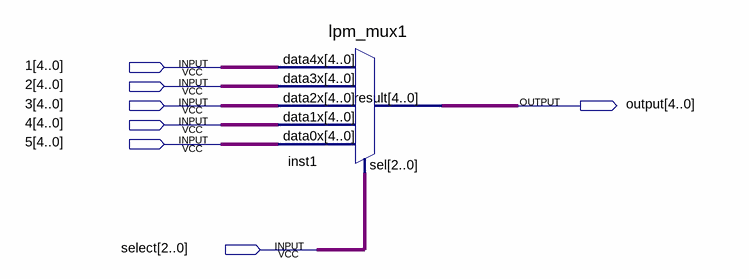
[diagram p0: schematic sheet]
// Quartus schematic mux_test.bdf as structural Verilog: 1 symbols, 7 pins
module mux_test (
  input  [4:0] \1 ,
  input  [4:0] \2 ,
  input  [4:0] \3 ,
  input  [4:0] \4 ,
  input  [4:0] \5 ,
  input  [2:0] select,
  output [4:0] \output 
);

  lpm_mux1 inst1 (
    .data4x(\1 ), .data3x(\2 ), .data2x(\3 ), .data1x(\4 ), .data0x(\5 ), .sel(select), .result(\output ));
endmodule
